# Altium project AltiumSTM32f411_1stProject.PrjPcb
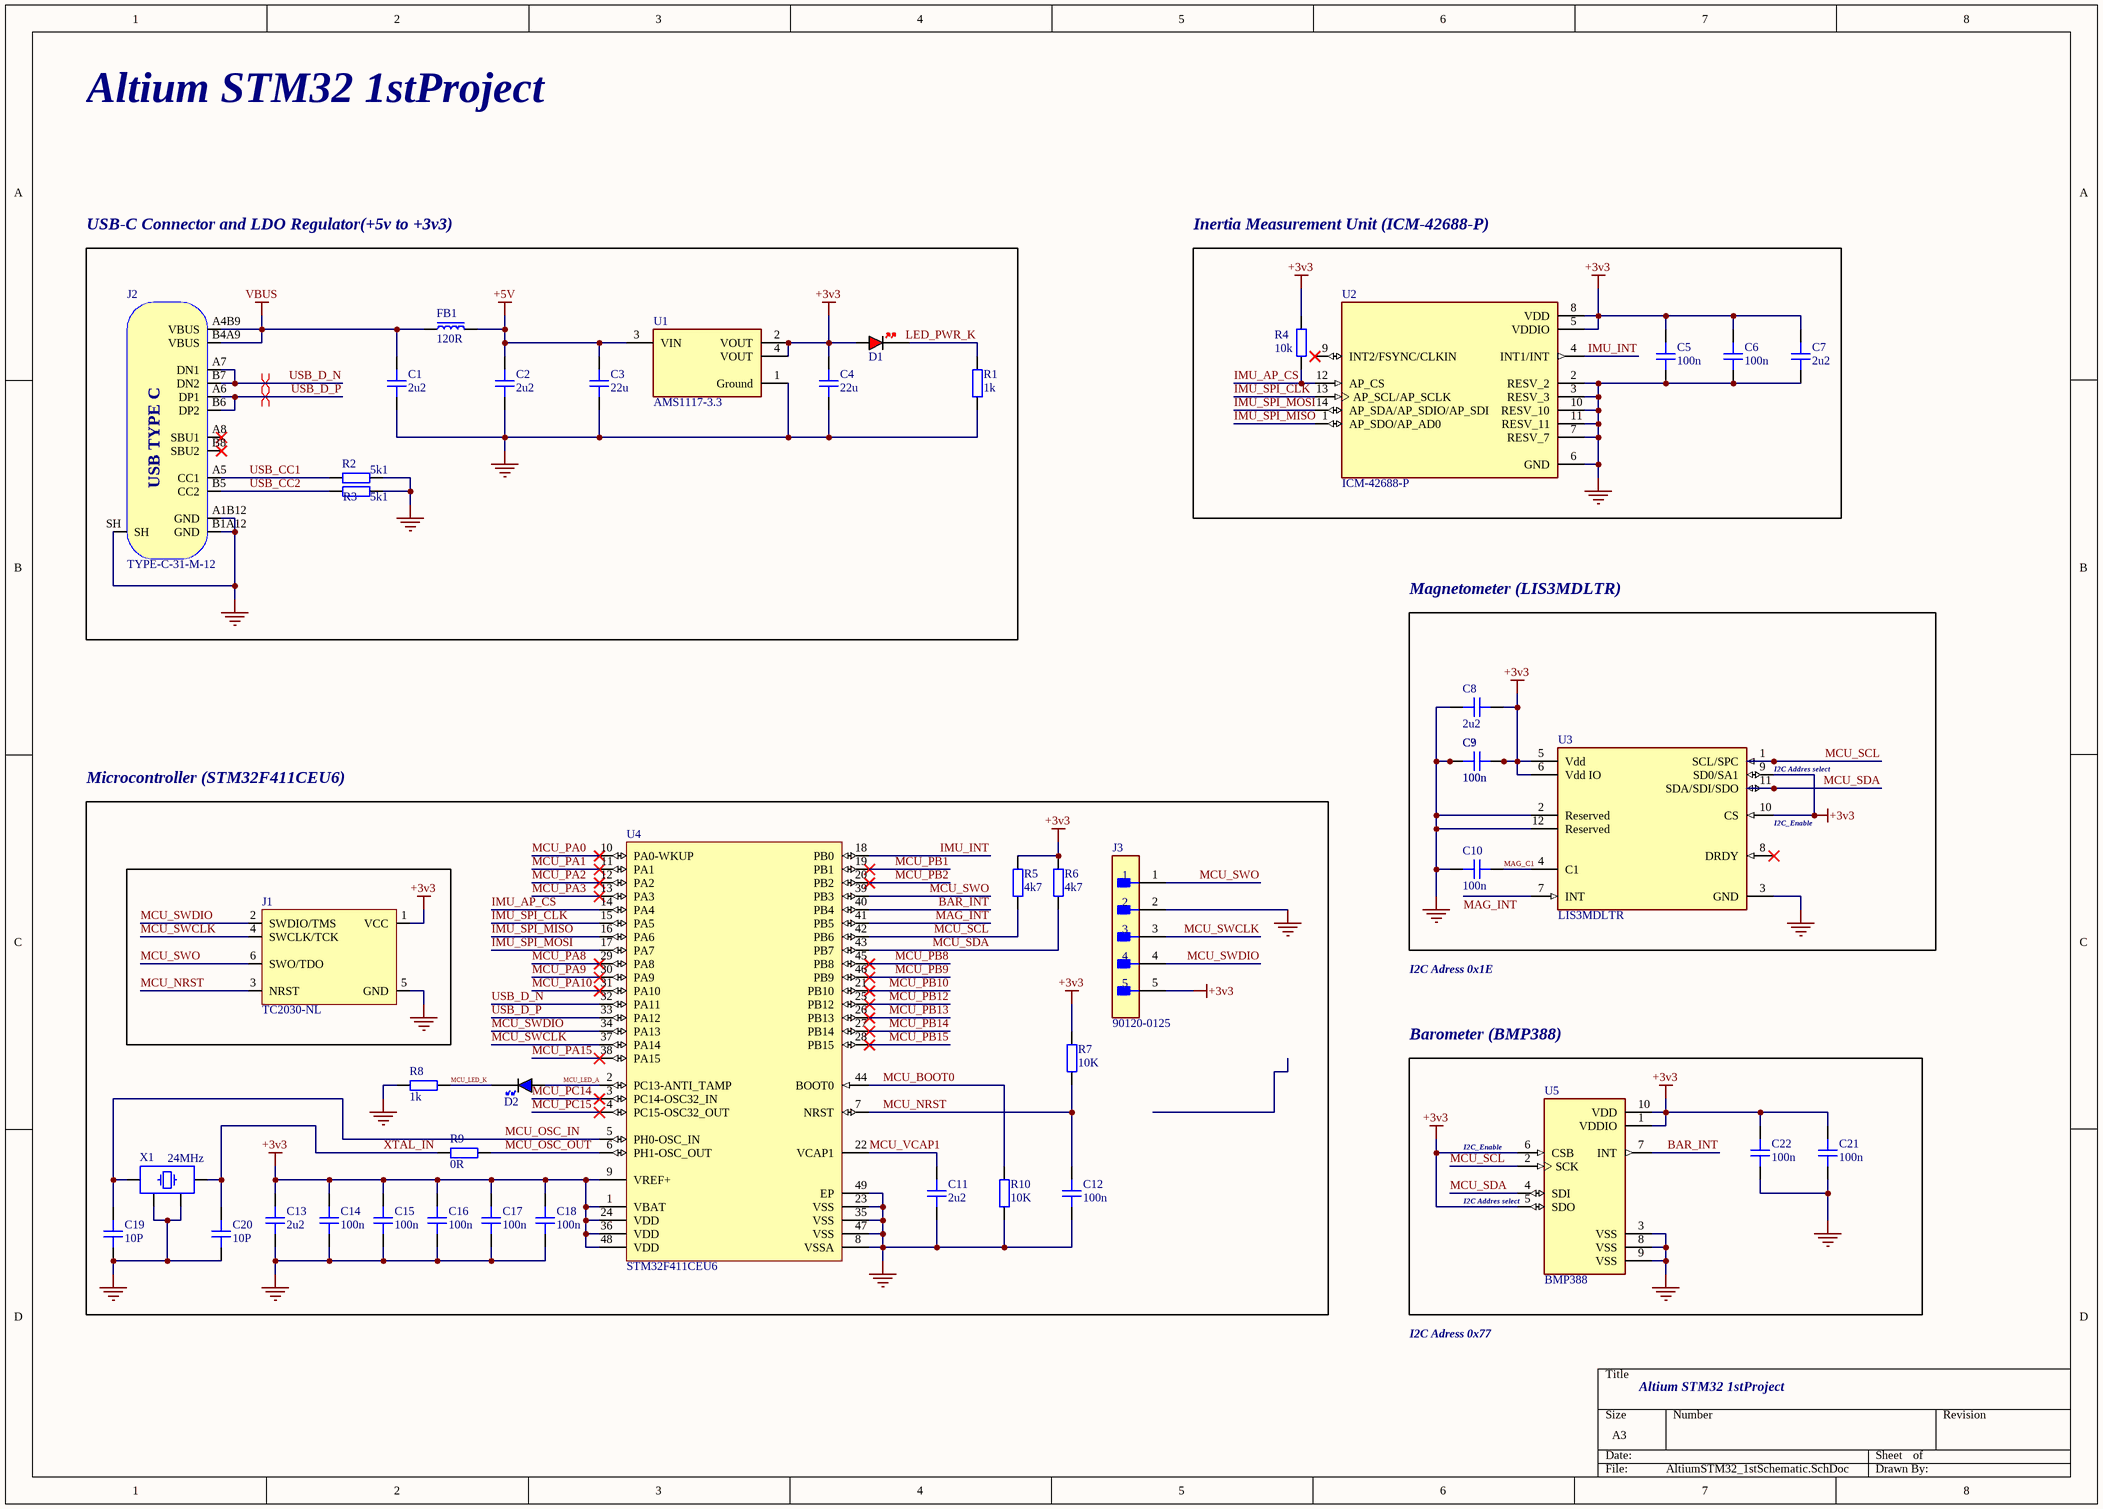
[diagram p0: AltiumSTM32_1stSchematic.SchDoc]
1 sheet, 45 parts. Net scope: global (net labels, ports and power ports of the same name join across sheets).
Board file: Altium_STM32_1stProject.PcbDoc

## Sheet AltiumSTM32_1stSchematic.SchDoc
size A3; SheetNumber: 1; SheetTotal: 1

### Parts
C1  2u2  [CAP_0603]
C2  2u2  [CAP_0603]
C3  22u  [CAP_0805]
C4  22u  [CAP_0805]
C5  100n  [CAP_0402]
C6  100n  [CAP_0402]
C7  2u2  [CAP_0603]
C8  2u2  [CAP_0603]
C9  100n  [CAP_0402]
C10  100n  [CAP_0402]
C11  2u2  [CAP_0603]
C12  100n  [CAP_0402]
C13  2u2  [CAP_0603]
C14  100n  [CAP_0402]
C15  100n  [CAP_0402]
C16  100n  [CAP_0402]
C17  100n  [CAP_0402]
C18  100n  [CAP_0402]
C19  10P  [CAP_0402]
C20  10P  [CAP_0402]
C21  100n  [CAP_0402]
C22  100n  [CAP_0402]
C?  100n  [CAP_0402]
D1  RED  [LED_0402_RED]  (value not drawn)
D2  BLUE  [LED_0402_BLUE]  (value not drawn)
FB1  120R  [FB_0603]
J1  TC2030-NL  [TC2030-NL-FP]  (no BOM)
J2  TYPE-C-31-M-12  [TYPE-C-31-M-12]
J3  90120-0125  [FP-90120-0125-MFG]
R1  1k  [RES_0402]
R2  5k1  [RES_0402]
R3  5k1  [RES_0402]
R4  10k  [RES_0402]
R5  4k7  [RES_0402]
R6  4k7  [RES_0402]
R7  10K  [RES_0402]
R8  1k  [RES_0402]
R9  0R  [RES_0402]
R10  10K  [RES_0402]
U1  AMS1117-3.3  [FP-AMS1117-IPC_C]
U2  ICM-42688-P  [PQFN50P300X250X97-14N]
U3  LIS3MDLTR  [FP-VFLGA-12-8365767-MFG]
U4  STM32F411CEU6  [STM-UFQFPN48_L]
U5  BMP388  [PQFN50P200X200X80-10N]
X1  24MHz  [XTAL_3225]

### Blocks framed on the sheet
USB-C Connector and LDO Regulator(+5v to +3v3): C1-C4 D1 FB1 J2 R1-R3 U1
Inertia Measurement Unit (ICM-42688-P): C5-C7 R4 U2
Magnetometer (LIS3MDLTR): C8-C10 C? U3
Microcontroller (STM32F411CEU6): C11-C20 D2 J1 J3 R5-R10 U4 X1
Barometer (BMP388): C21 C22 U5

### Nets
+3v3: C4.2 C5.1 C6.1 C7.2 C8.1 C9.1 C13.2 C14.2 C15.2 C16.2 C17.2 C18.2 C21.1 C22.1 C?.1 D1.A J1.1(VCC) J3.5 R4.2 R5.2 R6.2 R7.2 U1.2(VOUT) U1.4(VOUT) U2.5(VDDIO) U2.8(VDD) U3.5(Vdd) U3.6(Vdd_IO) U3.9(SD0/SA1) U3.10(CS) U4.1(VBAT) U4.9(VREF+) U4.24(VDD) U4.36(VDD) U4.48(VDD) U5.1(VDDIO) U5.5(SDO) U5.6(CSB) U5.10(VDD)
+5V: C2.2 C3.2 FB1.2 U1.3(VIN)
GND: C1.1 C2.1 C3.1 C4.1 C5.2 C6.2 C7.1 C8.2 C9.2 C10.2 C11.1 C12.1 C13.1 C14.1 C15.1 C16.1 C17.1 C18.1 C19.1 C20.1 C21.2 C22.2 C?.2 J1.5(GND) J2.A1B12(GND) J2.B1A12(GND) J2.SH J3.2 R1.2 R2.2 R3.2 R8.1 R10.1 U1.1(Ground) U2.2(RESV_2) U2.3(RESV_3) U2.6(GND) U2.7(RESV_7) U2.10(RESV_10) U2.11(RESV_11) U3.2(Reserved) U3.3(GND) U3.12(Reserved) U4.8(VSSA) U4.23(VSS) U4.35(VSS) U4.47(VSS) U4.49(EP) U5.3(VSS) U5.8(VSS) U5.9(VSS) X1.2 X1.4
VBUS: C1.2 FB1.1 J2.A4B9(VBUS) J2.B4A9(VBUS)
BAR_INT: U4.40(PB4) U5.7(INT)
IMU_AP_CS: R4.1 U2.12(AP_CS) U4.14(PA4)
IMU_INT: U2.4(INT1/INT) U4.18(PB0)
IMU_SPI_CLK: U2.13(AP_SCL/AP_SCLK) U4.15(PA5)
IMU_SPI_MISO: U2.1(AP_SDO/AP_AD0) U4.16(PA6)
IMU_SPI_MOSI: U2.14(AP_SDA/AP_SDIO/AP_SDI) U4.17(PA7)
LED_PWR_K: D1.K R1.1
MAG_C1: C10.1 U3.4(C1)
MAG_INT: U3.7(INT) U4.41(PB5)
MCU_BOOT0: R10.2 U4.44(BOOT0)
MCU_LED_A: D2.A U4.2(PC13-ANTI_TAMP)
MCU_LED_K: D2.K R8.2
MCU_NRST: C12.2 J1.3(NRST) R7.1 U4.7(NRST)
MCU_OSC_IN: C19.2 U4.5(PH0-OSC_IN) X1.1
MCU_OSC_OUT: R9.2 U4.6(PH1-OSC_OUT)
MCU_PA0: U4.10(PA0-WKUP)
MCU_PA1: U4.11(PA1)
MCU_PA2: U4.12(PA2)
MCU_PA3: U4.13(PA3)
MCU_PA8: U4.29(PA8)
MCU_PA9: U4.30(PA9)
MCU_PA10: U4.31(PA10)
MCU_PA15: U4.38(PA15)
MCU_PB1: U4.19(PB1)
MCU_PB2: U4.20(PB2)
MCU_PB8: U4.45(PB8)
MCU_PB9: U4.46(PB9)
MCU_PB10: U4.21(PB10)
MCU_PB12: U4.25(PB12)
MCU_PB13: U4.26(PB13)
MCU_PB14: U4.27(PB14)
MCU_PB15: U4.28(PB15)
MCU_PC14: U4.3(PC14-OSC32_IN)
MCU_PC15: U4.4(PC15-OSC32_OUT)
MCU_SCL: R5.1 U3.1(SCL/SPC) U4.42(PB6) U5.2(SCK)
MCU_SDA: R6.1 U3.11(SDA/SDI/SDO) U4.43(PB7) U5.4(SDI)
MCU_SWCLK: J1.4(SWCLK/TCK) J3.3 U4.37(PA14)
MCU_SWDIO: J1.2(SWDIO/TMS) J3.4 U4.34(PA13)
MCU_SWO: J1.6(SWO/TDO) J3.1 U4.39(PB3)
MCU_VCAP1: C11.2 U4.22(VCAP1)
USB_CC1: J2.A5(CC1) R2.1
USB_CC2: J2.B5(CC2) R3.1
USB_D_N: J2.A7(DN1) J2.B7(DN2) U4.32(PA11)
USB_D_P: J2.A6(DP1) J2.B6(DP2) U4.33(PA12)
XTAL_IN: C20.2 R9.1 X1.3

Not connected (* = marked no-connect by the designer): J2 A8(SBU1)* B8(SBU2)*; U2 9(INT2/FSYNC/CLKIN)*; U3 8(DRDY)*

### Layout directives
differential pair; differential pair class DIFF_USB: USB_D_N
differential pair: USB_D_P

### Notes on the sheet
- Altium STM32 1stProject
- (near U3) I2C Addres select
- (near U3) I2C_Enable
- I2C Adress 0x1E
- (near U5) I2C_Enable
- (near U5) I2C Addres select
- I2C Adress 0x77
- (in symbol TYPE-C-31-M-12) USB TYPE C

### Library data of the parts
C1 C2 C7 C8 C11 C13 = CAP_0603: Capacitor SMD 0603; Manufacturer: *; Manufacturer Part Number: *; Distributor Link: *; LCSC: *; Rating: *; Dielectric: *
C3 C4 = CAP_0805: Capacitor SMD 0805; Manufacturer: *; Manufacturer Part Number: *; Distributor Link: *; LCSC: *; Rating: *; Dielectric: *
C5 C6 C9 C10 C12 C14-C22 C? = CAP_0402: Capacitor SMD 0402; Manufacturer: *; Manufacturer Part Number: *; Distributor Link: *; LCSC: *; Rating: *; Dielectric: *
D1 = LED_0402_RED: LED 0402 RED SMD
D2 = LED_0402_BLUE: LED 0402 BLUE SMD
FB1 = FB_0603: Ferrite Bead SMD 0603; Manufacturer: *; Manufacturer Part Number: *; Distributor Link: *; LCSC: *
J1 = TC2030-NL: Tag-Connect No-Solder SWD Debug Connector (No Legs) DO NOT PLACE; Manufacturer: Tag-Connect; Manufacturer Part Number: TC2030-NL-FP
J2 = TYPE-C-31-M-12: USB Type C Connector Horizontal SMT; Manufacturer: Koren Hroparts; Manufacturer Part Number: TYPE-C-31-M-12
J3 = CMP-00257-00655425-1: 90120-0125 2.54mm Pitch C-Grid III Header, Single Row, Vertical, 5 Circuits, Tin (Sn) Plating; NexarPartId: 655425; Manufacturer Lifecycle Status: ACTIVE; Lead Length: 2.9mm; Number of Positions: 5; Current Rating: 3A; Mating Post Length: 6.75mm; Glow Wire Compliant: Non-compliant; Contact Resistance: 20mΩ; Voltage Rating: 350V; Gender: Male; Max Voltage Rating (DC): 350.35kV; Max Operating Temperature: 125°C; Number of Pins: 5; Plating: Tin; Contact Material: Brass; Mount: Through Hole; Contact Gender: Male; Packaging: Bulk; Schedule B: 8536694040; Lifecycle Status: Production; Lead Pitch: 2.54mm; Radiation Hardening: No; Orientation: Vertical; Min Operating Temperature: -55°C; Country of Origin: SK; Housing Color: Black; REACH SVHC: No SVHC; Contact Plating: Tin; Number of Rows: 1; Number of Circuits: 5; Termination: Solder; Number of Contacts: 5; Pitch: 2.54mm; Housing Material: Polyester; RoHS: Compliant; Lead Free: Lead Free; Voltage Rating (AC): 350V
R1-R10 = RES_0402: Resistor SMD 0402; Manufacturer: *; Manufacturer Part Number: *; Distributor Link: *; LCSC: *
U1 = CMP-209535-000001-1: LDO Voltage Regulators 1A, 3.3V; Manufacturer: Advanced Monolithic Systems; Dropout Voltage: 1.1V; Output Type: Fixed; Nominal Supply Current: 5mA; Max Power Dissipation: 1.2W; Max Supply Voltage: 15V; Number Of Outputs: 1; Standoff Height: 0.64mm; Max Junction Temp: +125°C; Height: 1.8mm; Package: AMS1117; Device Class L2: Power Management ICs; ComponentLink2Description: Datasheet; ComponentLink2URL: http://www.advanced-monolithic.com/pdf/ds1117.pdf; Category: IC; RoHS: TRUE; Automotive: No; Device Class L1: Integrated Circuits (ICs); Output Current: 1A; Device Class L3: Voltage Regulators - Linear; Temperature: -40°C to +125°C; Output Voltage: 3.3V; Manufacturer Part Number: AMS1117-3.3; Temperature Range Low: -40°C; Octopart: https://octopart.com/ams1117-3.3-advanced+monolithic+systems-25899300; Lead Free: Yes; Ipc Land Pattern Name: SOT229P700X180-4; Temperature Range High: +125°C
U2 = ICM-42688-P: Accelerometer, Gyroscope, 6 Axis Sensor Output; Package: None; MP: ICM-42688-P; Value: *; Availability: Unavailable; Price: None
U3 = CMP-2000-07463-2: SENSOR MR I2C/SPI 12LGA; Manufacturer: STMicroelectronics; Sensor Output: I2C,SPI; Operating Supply Current: 40-270uA; Max Supply Voltage: 3.6V; Sensing Method: Magnetic; Min Supply Voltage: 1.71V; Description: Board Mount Hall Effect / Magnetic Sensors Ultra Lo-Pwr Hi Perf 3-Axis 1.9-3.6V; ComponentLink2URL: https://www.st.com/resource/en/datasheet/lis3mdl.pdf; Category: IC; Manufacturer Part Number: LIS3MDLTR; Octopart: https://octopart.com/lis3mdltr-stmicroelectronics-29403125; Automotive: No; ComponentLink2Description: Datasheet; RoHS: TRUE; Device Class L3: unset; Device Class L1: Sensors; Temperature: -40°C to +85°C; Height: 1mm; Mouser Description: Board Mount Hall Effect / Magnetic Sensors Ultra Lo-Pwr Hi Perf 3-Axis 1.9-3.6V; Temperature Range High: +85°C; Lead Free: Yes; Device Class L2: Magnetic Sensors; Footprint Url: https://www.st.com/content/ccc/resource/technical/document/technical_note/73/17/9c/16/dd/96/4a/01/CD00134799.pdf/files/CD00134799.pdf/jcr:content/translations/en.CD00134799.pdf; Temperature Range Low: -40°C; Package: VFLGA-12-8365767; Digikey Description: SENSOR MR I2C/SPI 12LGA
U4 = CMP-0243-00165-1: ARM Cortex-M4 32-bit MCU+FPU, 512 KB Flash, 128 KB RAM, 36 I/Os, 48-Pin UFQFPN, -40 to 85 degC, Tray; Operating Frequency(F) (Processor speed) (MHz): 100; FLASH Size (Prog) (kB): 512; Internal RAM Size (kB): 128; I/Os (High Current): 36; Supply Voltage(Vcc) min (V): 1.7; Package Reference: 48-Pin Ultra Thin Fine Pitch Quad Flat No-Lead, 7 x 7 x 0.6 mm Body, 0.5 mm Pitch, Exposed Pad; ComponentLink1Description: Manufacturer URL; ComponentLink1URL: http://www.st.com/; Packing: Tray; Package Description: UFQFPN48; Core: ARM Cortex-M4; ComponentLink2Description: Datasheet; ComponentLink2URL: http://www.st.com/st-web-ui/static/active/en/resource/technical/document/datasheet/DM00115249.pdf; DatasheetVersion: Rev. 6; Mounting Technology: Surface Mount
U5 = BMP388: P-Sensor SPI I2C 1, 25 Bar SMD; Package: None; Price: None; Value: *; MP: BMP388; Availability: Unavailable
X1 = TSX-3225_24.0000MF15X-AC: Crystal SMD 24MHz 10PPM 7pF 3225; Manufacturer: Epson; Manufacturer Part Number: TSX-3225 24.0000MF15X-AC